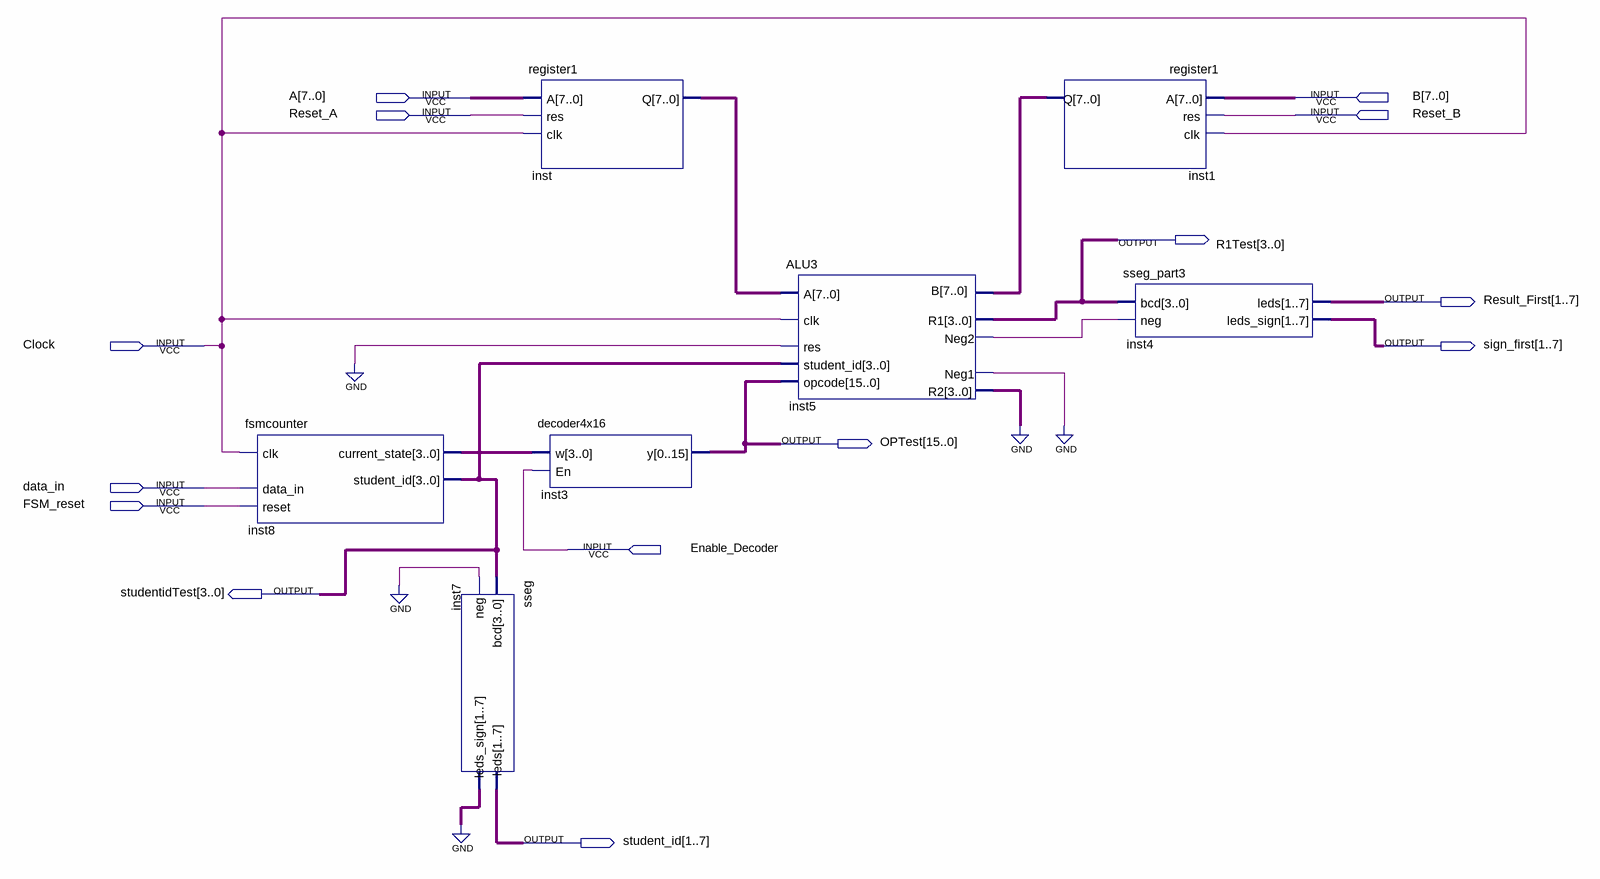
[diagram p0: schematic sheet]
// Quartus schematic Lab6_Part3.bdf as structural Verilog: 7 symbols, 14 pins
module Lab6_Part3 (
  input  [7:0] A,
  input  [7:0] B,
  input  Reset_A,
  input  Reset_B,
  input  Clock,
  input  data_in,
  input  FSM_reset,
  input  Enable_Decoder,
  output [3:0] R1Test,
  output [1:7] Result_First,
  output [1:7] sign_first,
  output [15:0] OPTest,
  output [3:0] studentidTest,
  output [1:7] student_id
);

  wire inst5_neg1, inst5_neg2;
  wire [3:0] inst5_r2, inst8_current_state;
  wire [6:0] inst7_leds_sign;
  wire [7:0] inst1_q, inst_q;

  fsmcounter inst8 (
    .data_in(data_in), .clk(Clock), .reset(FSM_reset), .student_id(studentidTest),
    .current_state(inst8_current_state));
  sseg inst7 (.bcd(studentidTest), .neg(1'b0), .leds(student_id), .leds_sign(inst7_leds_sign));
  register1 inst (.A(A), .res(Reset_A), .clk(Clock), .Q(inst_q));
  decoder4x16 inst3 (.w(inst8_current_state), .En(Enable_Decoder), .y(OPTest));
  ALU3 inst5 (
    .clk(Clock), .res(1'b0), .A(inst_q), .B(inst1_q), .student_id(studentidTest), .opcode(OPTest),
    .Neg1(inst5_neg1), .Neg2(inst5_neg2), .R1(R1Test), .R2(inst5_r2));
  register1 inst1 (.A(B), .res(Reset_B), .clk(Clock), .Q(inst1_q));
  sseg_part3 inst4 (.bcd(R1Test), .neg(inst5_neg2), .leds(Result_First), .leds_sign(sign_first));
  // also tied to GND on the sheet: {inst7_leds_sign[0], inst7_leds_sign[1], inst7_leds_sign[2], inst7_leds_sign[3], inst7_leds_sign[4], inst7_leds_sign[5], inst7_leds_sign[6], inst5_r2[0], inst5_r2[1], inst5_r2[2], inst5_r2[3], inst5_neg1}
endmodule
